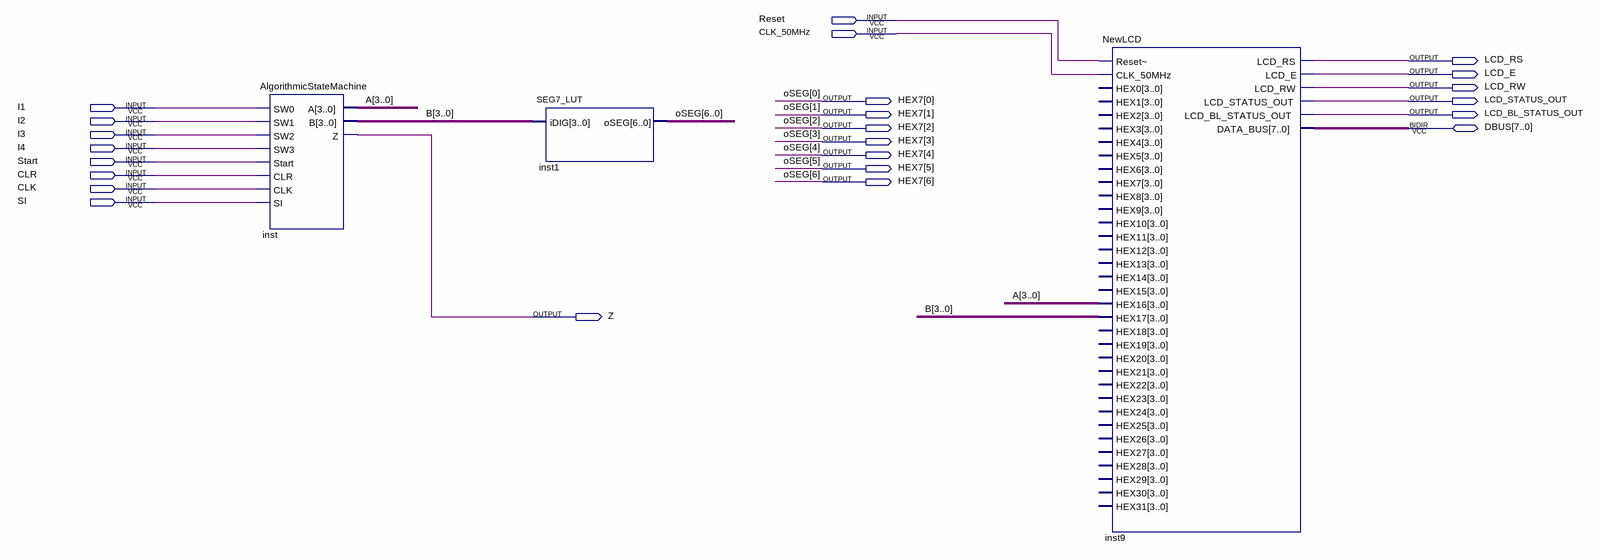
[diagram p0: schematic sheet]
// Quartus schematic AlgorithmicStateMachine_LCD.bdf as structural Verilog: 3 symbols, 24 pins
module AlgorithmicStateMachine_LCD (
  input  Reset,
  input  CLK_50MHz,
  input  I1,
  input  I2,
  input  I3,
  input  I4,
  input  Start,
  input  CLR,
  input  CLK,
  input  SI,
  inout  [7:0] DBUS,
  output LCD_RS,
  output LCD_E,
  output LCD_RW,
  output [6:0] HEX7,
  output LCD_STATUS_OUT,
  output LCD_BL_STATUS_OUT,
  output Z
);

  wire [3:0] A, B;

  AlgorithmicStateMachine inst (
    .SW0(I1), .SW1(I2), .SW2(I3), .SW3(I4), .Start(Start), .CLR(CLR), .CLK(CLK), .SI(SI), .A(A), .B(B), .Z(Z));
  SEG7_LUT inst1 (.iDIG(B), .oSEG(HEX7));
  NewLCD inst9 (
    .\Reset~ (Reset), .CLK_50MHz(CLK_50MHz), .HEX16(A), .HEX17(B), .LCD_RS(LCD_RS), .LCD_E(LCD_E),
    .LCD_RW(LCD_RW), .LCD_STATUS_OUT(LCD_STATUS_OUT), .LCD_BL_STATUS_OUT(LCD_BL_STATUS_OUT), .DATA_BUS(DBUS));  // open: HEX0, HEX1, HEX2, HEX3, HEX4, HEX5, HEX6, HEX7, HEX8, HEX9, HEX10, HEX11, HEX12, HEX13, HEX14, HEX15, HEX18, HEX19, HEX20, HEX21, HEX22, HEX23, HEX24, HEX25, HEX26, HEX27, HEX28, HEX29, HEX30, HEX31

  // Other names for the same wires on the sheet: oSEG[6:0] = HEX7
endmodule
